# Altium schematic sheet 3V3_MCU.SchDoc
size A4; SheetNumber: 8; SheetTotal: 16
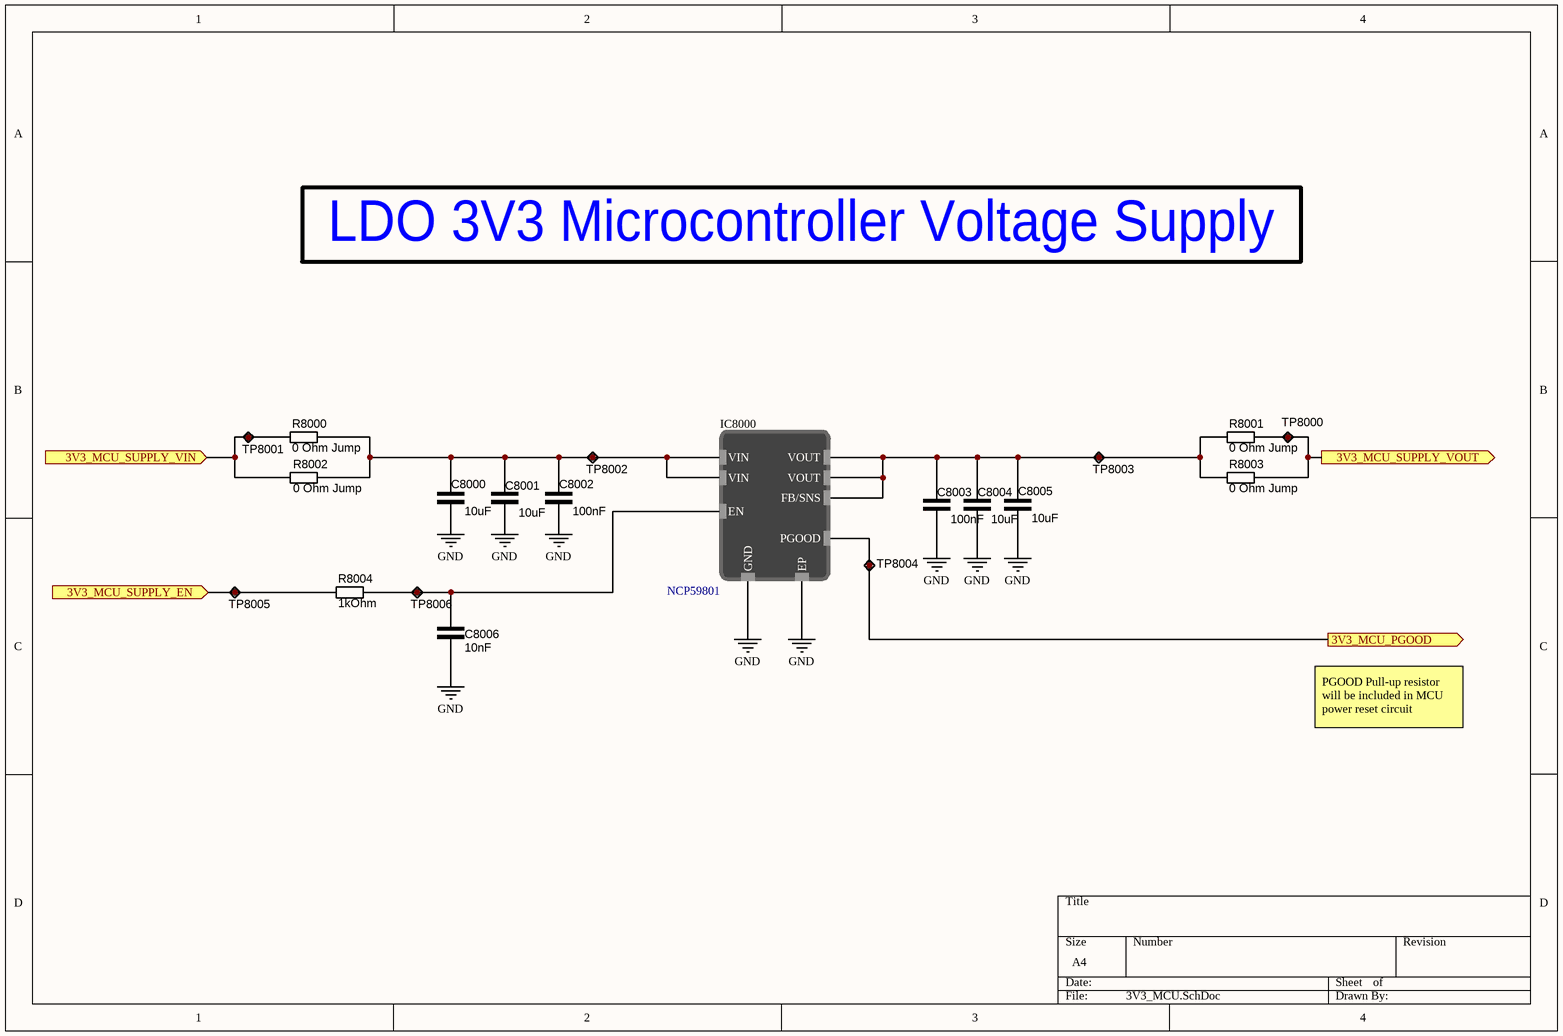
[diagram p0: 3V3_MCU.SchDoc]

## Parts
C8000  10uF  [CAP_0805]
C8001  10uF  [CAP_0805]
C8002  100nF  [CAP_0603]
C8003  100nF  [CAP_0603]
C8004  10uF  [CAP_0805]
C8005  10uF  [CAP_0805]
C8006  10nF  [CAP_0603]
IC8000  NCP59801  [DFNW8_3x3]
R8000  0 Ohm Jump  [RES_0603]
R8001  0 Ohm Jump  [RES_0805]
R8002  0 Ohm Jump  [RES_0603]
R8003  0 Ohm Jump  [RES_0805]
R8004  1kOhm  [RES_0603]
TP8000  Test point  [TestPoint]  (value not drawn)
TP8001  Test point  [TestPoint]  (value not drawn)
TP8002  Test point  [TestPoint]  (value not drawn)
TP8003  Test point  [TestPoint]  (value not drawn)
TP8004  Test point  [TestPoint]  (value not drawn)
TP8005  Test point  [TestPoint]  (value not drawn)
TP8006  Test point  [TestPoint]  (value not drawn)

## Ports
3V3_MCU_PGOOD (out, see POWER_DELIVERY_AND_MONITORING[4C]), 3V3_MCU_SUPPLY_EN (in, see POWER_DELIVERY_AND_MONITORING[4C]), 3V3_MCU_SUPPLY_VIN (in, see POWER_DELIVERY_AND_MONITORING[4C]), 3V3_MCU_SUPPLY_VOUT (out, see POWER_DELIVERY_AND_MONITORING[4C], POWER_DELIVERY_AND_MONITORING[4B])

## Nets
GND: C8003.1 C8004.1 C8005.2 C8006.1 IC8000.4(GND) IC8000.9(EP)
3V3_MCU_PGOOD: IC8000.6(PGOOD) TP8004.1 ; port 3V3_MCU_PGOOD
3V3_MCU_SUPPLY_EN: R8004.1 TP8005.1 ; port 3V3_MCU_SUPPLY_EN
3V3_MCU_SUPPLY_VIN: R8000.1 R8002.2 TP8001.1 ; port 3V3_MCU_SUPPLY_VIN
3V3_MCU_SUPPLY_VOUT: R8001.2 R8003.2 TP8000.1 ; port 3V3_MCU_SUPPLY_VOUT
NetC8000_1: C8000.1 C8001.2 C8002.1 IC8000.7(VIN) IC8000.8(VIN) R8000.2 R8002.1 TP8002.1
NetC8003_2: C8003.2 C8004.2 C8005.1 IC8000.1(VOUT) IC8000.2(VOUT) IC8000.3(FB/SNS) R8001.1 R8003.1 TP8003.1
NetC8006_2: C8006.2 IC8000.5(EN) R8004.2 TP8006.1

Not connected (* = marked no-connect by the designer): C8000 2; C8001 1; C8002 2

## Notes on the sheet
- LDO 3V3 Microcontroller Voltage Supply
- PGOOD Pull-up resistor will be included in MCU power reset circuit
- Labels drawn without touching a wire or pin: GND

## Library data of the parts
C8000 C8001 C8004 C8005 = C000002: 10 µF ±10% 25V Ceramic Capacitor X5R 0805 (2012 Metric); ComponentLink1Description: DigiKey; ComponentLink1URL: https://www.digikey.com/en/products/detail/tdk-corporation/C2012X5R1E106K125AB/2443462; DigiKey Part Number: 445-5984-1-ND; capacitance: 10uF
C8002 C8003 = C000007: 0.1 µF ±10% 25V Ceramic Capacitor X7R 0603 (1608 Metric); ComponentLink1Description: DigiKey; ComponentLink1URL: https://www.digikey.com/en/products/detail/kyocera-avx/06033C104K4T2A/8019250; DigiKey Part Number: 478-KAM15AR71E104KTCT-ND; capacitance: 100nF
C8006 = C000005: 10000 pF ±20% 25V Ceramic Capacitor X7R 0603 (1608 Metric); ComponentLink1Description: DigiKey; ComponentLink1URL: https://www.digikey.com/en/products/detail/kyocera-avx/06033C103MAT2A/1599370; DigiKey Part Number: 478-KGM15AR71E103MTCT-ND; capacitance: 10nF
IC8000 = NCP59801: Linear Voltage Regulator IC Positive Fixed 1 Output 1A 8-DFNW (3x3); Manufacturer Product Number: NCP59801CML330TCG; DigiKey Part Number: 488-NCP59801CML330TCGCT-ND; ComponentLink1Description: DigiKey; ComponentLink1URL: https://www.digikey.com/en/products/detail/onsemi/NCP59801CML330TCG/17868225; Mouser Part Number: 863-CP59801CML330TCG; ComponentLink2Description: Mouser; ComponentLink2URL: https://eu.mouser.com/ProductDetail/onsemi/NCP59801CML330TCG?qs=vvQtp7zwQdM1Va2lUiPUkg%3D%3D; JLCPCB Part Number: C5209184
R8000 R8002 = R000007: 0 Ohms Jumper Chip Resistor 0603 (1608 Metric) Automotive AEC-Q200 Thick Film; ComponentLink1Description: DigiKey; ComponentLink1URL: https://www.digikey.com/en/products/detail/stackpole-electronics-inc/RMCF0603ZT0R00/1756908; resistance: 0 Ohm Jump; DigiKey Part Number: RMCF0603ZT0R00CT-ND
R8001 R8003 = R000011: 0 Ohms Jumper Chip Resistor 0805 (2012 Metric) Automotive AEC-Q200 Thick Film; ComponentLink1Description: DigiKey; ComponentLink1URL: https://www.digikey.com/en/products/detail/panasonic-electronic-components/ERJ-6GEY0R00V/78163; resistance: 0 Ohm Jump; DigiKey Part Number: P0.0ACT-ND
R8004 = R000004: 1 kOhms ±1% 0.125W, 1/8W Chip Resistor 0603 (1608 Metric) Anti-Sulfur Thin Film; resistance: 1kOhm; ComponentLink1Description: DigiKey; ComponentLink1URL: https://www.digikey.com/en/products/detail/vishay-beyschlag-draloric-bc-components/MCT06030C1001FP500/2607821; DigiKey Part Number: MCT0603-1.00K-CFCT-ND
TP8000-TP8006 = TP002: Test point 1mm